# Altium schematic sheet FPGA_Z80_Counter.SchDoc
size B; Organization: Altium Limited; Address1: L3, 12a Rodborough Rd; Address2: Frenchs Forest; Address3: NSW; Address4: Australia 2086; DocumentNumber: 1; SheetNumber: 1; SheetTotal: 2
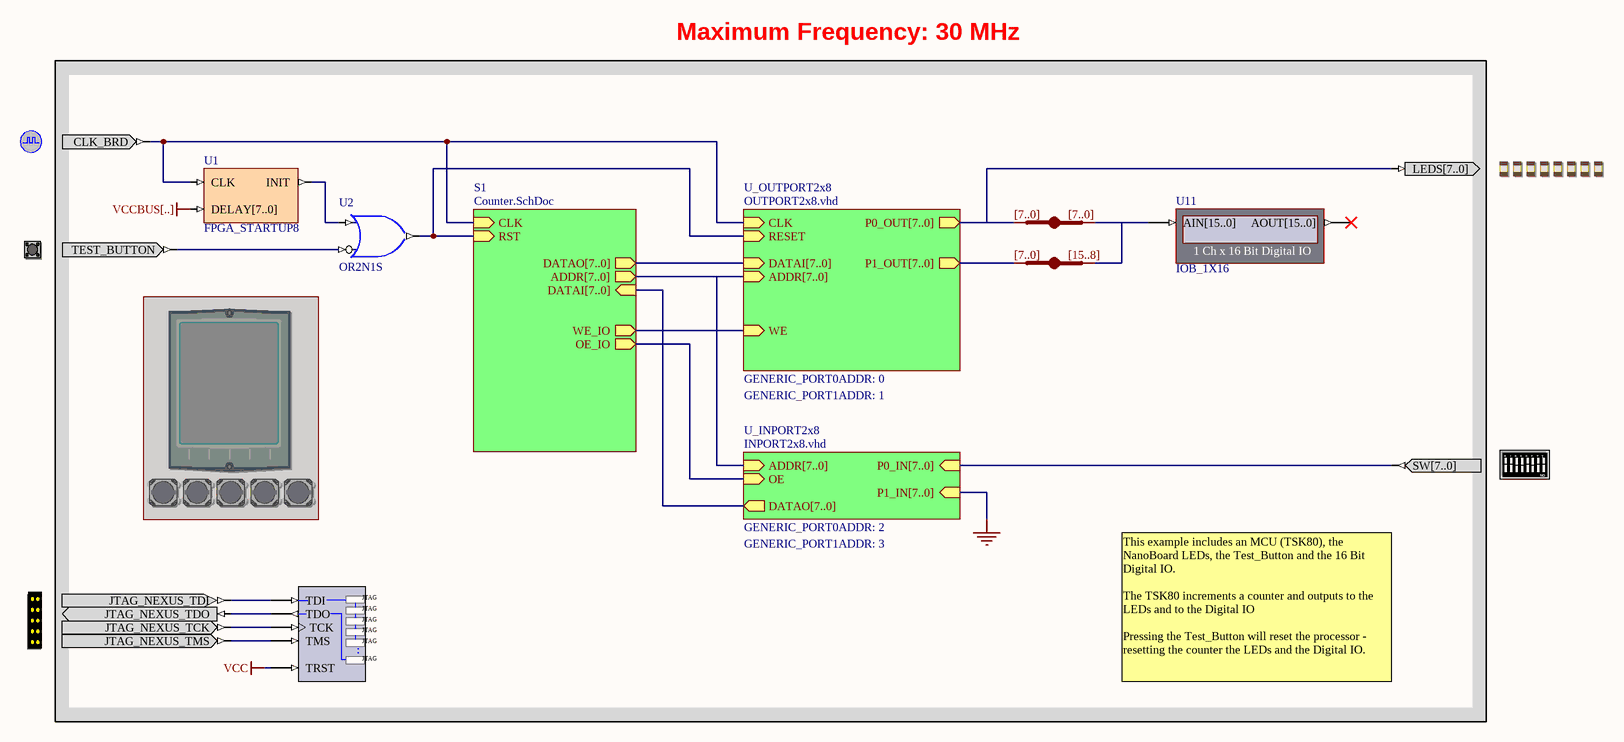
[diagram p0: FPGA_Z80_Counter.SchDoc]

## Parts
(Parts that share a designator on the sheet are numbered #1, #2 ... from top to bottom, then left to right.)
?#1  CLOCK_BOARD  (value not drawn)
?#2  LED  (value not drawn)
?#3  TEST_BUTTON  (value not drawn)
?#4  FIRMWARE_TFT_ENABLE  (value not drawn)  (masked out: inside a compile mask, not in the netlist)
?#5  DIPSWITCH  (value not drawn)
?#6  FIRMWARE_BUTTONS_ENABLE  (value not drawn)  (masked out: inside a compile mask, not in the netlist)
?#7  NEXUS_JTAG_CONNECTOR  (value not drawn)
NEXUS_JTAG_PORT  NEXUS_JTAG_PORT  (value not drawn)
U1  FPGA_STARTUP8
U2  OR2N1S
U7  IndexA: [7..0]  (hidden comment: JB)
U9  IndexA: [7..0]  IndexB: [15..8]  (hidden comment: JB)
U11  IOB_1X16

## Sub-sheets
S1 = Counter.SchDoc: CLK (in), RST (in), DATAO[7..0] (out), ADDR[7..0] (out), OE_IO (out), DATAI[7..0] (in), WE_IO (out)
U_INPORT2x8 = INPORT2x8.vhd: ADDR[7..0] (in), DATAO[7..0] (out), OE (in), P0_IN[7..0] (in), P1_IN[7..0] (in)  | VHDLENTITY: INPORT2x8; GENERIC_PORT0ADDR: 2; GENERIC_PORT1ADDR: 3
U_OUTPORT2x8 = OUTPORT2x8.vhd: ADDR[7..0] (in), CLK (in), DATAI[7..0] (in), P0_OUT[7..0] (out), P1_OUT[7..0] (out), RESET (in), WE (in)  | VHDLENTITY: OUTPORT2x8; GENERIC_PORT0ADDR: 0; GENERIC_PORT1ADDR: 1

## Nets
VCC: NEXUS_JTAG_PORT.TRST
VCCBUS[..]: U1.DELAY[7..0]
Net?#1_CLK_BRD: ?#1.CLK_BRD U1.CLK ; sheet S1/CLK, sheet U_OUTPORT2x8/CLK
Net?#2_LEDS[7..0]: ?#2.LEDS[7..0] U7.A[0..0] ; sheet U_OUTPORT2x8/P0_OUT[7..0]
Net?#3_TEST_BUTTON: ?#3.TEST_BUTTON U2.I0
Net?#5_SW[7..0]: ?#5.SW[7..0] ; sheet U_INPORT2x8/P0_IN[7..0]
Net?#7_JTAG_NEXUS_TCK: ?#7.JTAG_NEXUS_TCK NEXUS_JTAG_PORT.TCK
Net?#7_JTAG_NEXUS_TDI: ?#7.JTAG_NEXUS_TDI NEXUS_JTAG_PORT.TDI
Net?#7_JTAG_NEXUS_TDO: ?#7.JTAG_NEXUS_TDO NEXUS_JTAG_PORT.TDO
Net?#7_JTAG_NEXUS_TMS: ?#7.JTAG_NEXUS_TMS NEXUS_JTAG_PORT.TMS
NetU1_INIT: U1.INIT U2.I1
NetU2_O: U2.O ; sheet S1/RST, sheet U_OUTPORT2x8/RESET
NetU7_B[0..0]: U7.B[0..0] U9.B[0..0] U11.AIN[15..0]
NetU9_A[0..0]: U9.A[0..0] ; sheet U_OUTPORT2x8/P1_OUT[7..0]
(unnamed): sheet S1/OE_IO, sheet U_INPORT2x8/OE
(unnamed): sheet S1/WE_IO, sheet U_OUTPORT2x8/WE

Not connected (* = marked no-connect by the designer): U11 AOUT[15..0]*

## Buses and harness runs
bus sheet S1/ADDR[7..0] = sheet U_INPORT2x8/ADDR[7..0] = sheet U_OUTPORT2x8/ADDR[7..0]
bus sheet S1/DATAI[7..0] = sheet U_INPORT2x8/DATAO[7..0]
bus sheet S1/DATAO[7..0] = sheet U_OUTPORT2x8/DATAI[7..0]

## Notes on the sheet
- Maximum Frequency: 30 MHz
- This example includes an MCU (TSK80), the NanoBoard LEDs, the Test_Button and the 16 Bit Digital IO.
  The TSK80 increments a counter and outputs to the LEDs and to the Digital IO
  Pressing the Test_Button will reset the processor - resetting the counter the LEDs and the Digital IO.
- Title
- Size:
- Date:
- B
- Number:
- Time:
- Revision:
- Sheet
- of
- File:
- (in symbol DIPSWITCH) 8; 7; 6; 5; 4; 3; 2; 1; ON
- (in symbol NEXUS_JTAG_PORT) JTAG; .

## Library data of the parts
?#1 = CLOCK_BOARD: Global System Clock Supply; PortComponent: True; Published: 19-Nov-2003; Publisher: Altium Limited; HelpURL: TR0143 Technical Reference Manual for Altium's Desktop NanoBoard NB2DSK01.pdf#page=41; UseInDSF: True
?#2 = LED: Bank of eight Red LEDs; PortComponent: True; Published: 19-Nov-2003; Publisher: Altium Limited; HelpURL: TR0143 Technical Reference Manual for Altium's Desktop NanoBoard NB2DSK01.pdf#page=51
?#3 = TEST_BUTTON: Test / Reset Button; PortComponent: True; Published: 19-Nov-2003; Publisher: Altium Limited; HelpURL: TR0143 Technical Reference Manual for Altium's Desktop NanoBoard NB2DSK01.pdf#page=53
?#4 = FIRMWARE_TFT_ENABLE: TFT LCD Panel; PortComponent: True; Published: 22-Jan-2007; Publisher: Altium Limited; HelpURL: TR0143 Technical Reference Manual for Altium's Desktop NanoBoard NB2DSK01.pdf#page=50
?#5 = DIPSWITCH: 8-Way Dip-Switch; PortComponent: True; Published: 19-Nov-2003; Publisher: Altium Limited; HelpURL: TR0143 Technical Reference Manual for Altium's Desktop NanoBoard NB2DSK01.pdf#page=51
?#6 = FIRMWARE_BUTTONS_ENABLE: Generic User Buttons; PortComponent: True; Published: 16-Apr-2007; Publisher: Altium Limited; HelpURL: TR0143 Technical Reference Manual for Altium's Desktop NanoBoard NB2DSK01.pdf#page=53
?#7 = NEXUS_JTAG_CONNECTOR: JTAG Port; PortComponent: True; Published: 19-Nov-2003; Publisher: Altium Limited; HelpURL: TR0102 NanoBoard Technical Reference Manual - NB1.pdf#page=33
NEXUS_JTAG_PORT = NEXUS_JTAG_PORT: Soft Nexus-Chain Connector; NEXUS_JTAG_CONNECTOR: True; Published: 18-Dec-2003; Publisher: Altium Limited
U1 = FPGA_STARTUP8: FPGA Startup With 8 Bit Delay; Published: 21/01/2004; Publisher: Altium Hobart Technology Centre; Core Revision: 1.00.00
U2 = OR2N1S: 2-Input OR Gate with Active Low A Input, Single Pin Version; Xilinx Equivalent: OR2B1; ArchiveName: GENERIC; Published: 18-Dec-2003; Publisher: Altium Limited; Core Revision: 1.00.00
U7 U9 = JB: System BUS Joiner; ArchiveName: GENERIC; Published: 18-Dec-2003; Publisher: Altium Limited; Core Revision: 1.00.00
  U7: IndexB: [7..0]
U11 = IOB_1X16: 1 Ch x 16 Bit Digital IO; NEXUS_CORE: Instrument; NEXUS_JTAG_DEVICE: True; NEXUS_JTAG_ORDER: 0; Published: 30/09/2003; Publisher: Altium Hobart Technology Centre; Core Revision: 1.00.00